# EAGLE design _logo (EAGLE 9.5.0)
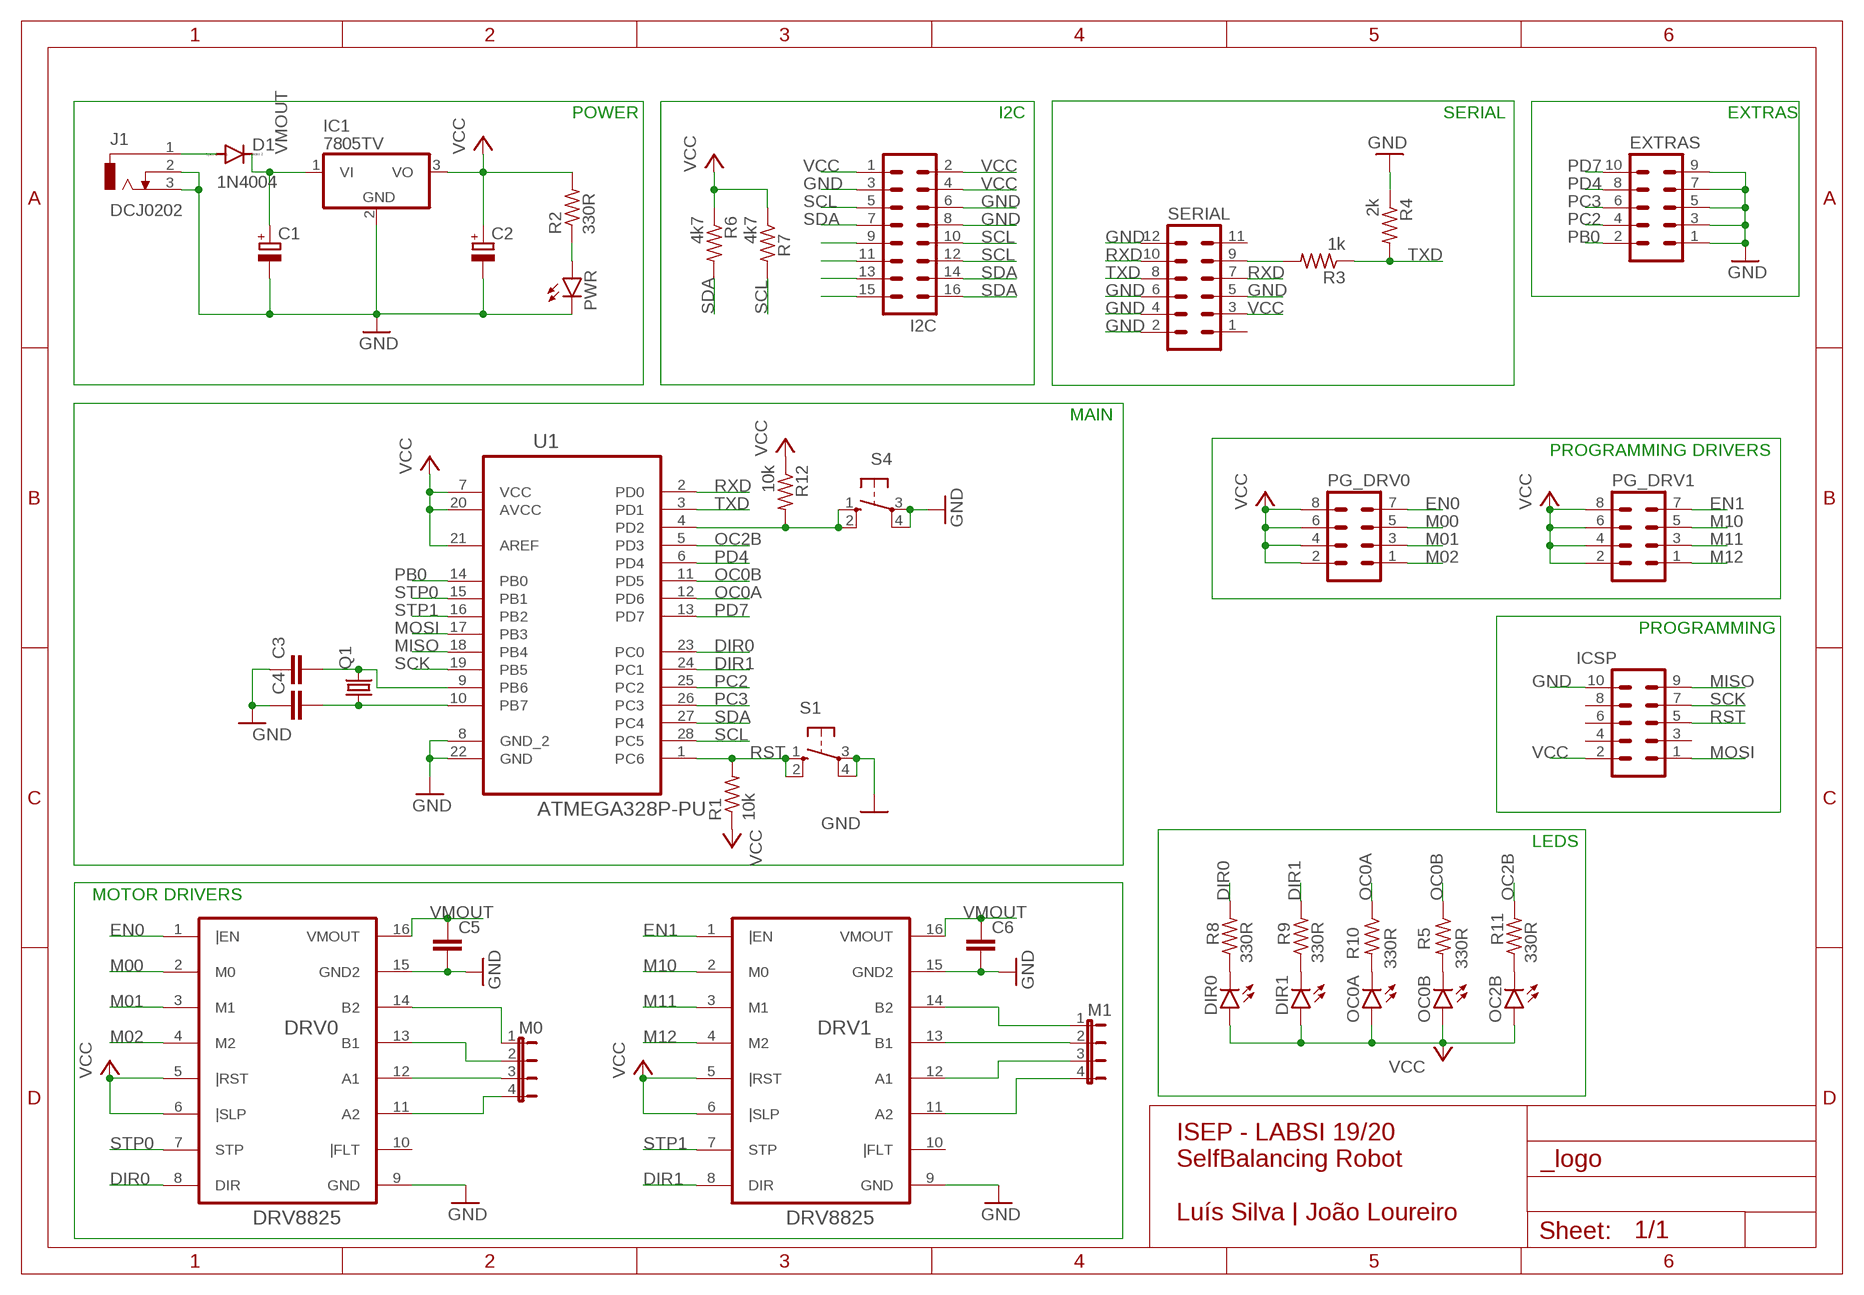
[diagram p0: schematic, sheet 1]

## Parts
C1  CPOL-EUB45181A  [B45181A]
C2  CPOL-EUB45181A  [B45181A]
C3  C5/3  [C5B3]
C4  C5/3  [C5B3]
C5  C2.5/2  [C2.5-2]
C6  C2.5/2  [C2.5-2]
D1  1N4004  [DO41-10]
DIR0  LED3MM  [LED3MM]
DIR1  LED3MM  [LED3MM]
DRV0  DRV8825  [DRV8825]
DRV1  DRV8825  [DRV8825]
EXTRAS  ML10  [ML10]
I2C  MA08-2  [MA08-2]
IC1  7805TV  [TO220V]
ICSP  ML10  [ML10]
J1  DCJ0202  [DCJ0202]
M0  JP4E  [JP4]
M1  JP4E  [JP4]
OC0A  LED3MM  [LED3MM]
OC0B  LED3MM  [LED3MM]
OC2B  LED3MM  [LED3MM]
PG_DRV0  MA04-2  [MA04-2]
PG_DRV1  MA04-2  [MA04-2]
PWR  LED3MM  [LED3MM]
Q1  CRYSTALHC49S  [HC49/S]
R1  10k  R-US_0207/10  [0207/10]
R2  330R  R-US_0207/10  [0207/10]
R3  1k  R-US_0207/10  [0207/10]
R4  2k  R-US_0207/10  [0207/10]
R5  330R  R-US_0207/10  [0207/10]
R6  4k7  R-US_0207/10  [0207/10]
R7  4k7  R-US_0207/10  [0207/10]
R8  330R  R-US_0207/10  [0207/10]
R9  330R  R-US_0207/10  [0207/10]
R10  330R  R-US_0207/10  [0207/10]
R11  330R  R-US_0207/10  [0207/10]
R12  10k  R-US_0207/10  [0207/10]
S1  10-XX  [B3F-10XX]
S4  10-XX  [B3F-10XX]
SERIAL  MA06-2  [MA06-2]
U1  ATMEGA328P-PU  [DIP254P762X457-28]

## Nets
DIR0: DRV0.8(DIR) R8.2 U1.23(PC0)
DIR1: DRV1.8(DIR) R9.2 U1.24(PC1)
EN0: DRV0.1(|EN) PG_DRV0.7
EN1: DRV1.1(|EN) PG_DRV1.7
GND [power]: C1.- C2.- C3.1 C4.1 C5.2 C6.2 DRV0.9(GND) DRV0.15(GND2) DRV1.9(GND) DRV1.15(GND2) EXTRAS.1 EXTRAS.3 EXTRAS.5 EXTRAS.7 EXTRAS.9 I2C.3 I2C.6 I2C.8 IC1.2(GND) ICSP.10 J1.2 J1.3 PWR.K(C) R4.1 S1.3(P) S1.4(P1) S4.3(P) S4.4(P1) SERIAL.2 SERIAL.4 SERIAL.5 SERIAL.6 SERIAL.12 U1.8(GND_2) U1.22(GND)
M00: DRV0.2(M0) PG_DRV0.5
M01: DRV0.3(M1) PG_DRV0.3
M02: DRV0.4(M2) PG_DRV0.1
M10: DRV1.2(M0) PG_DRV1.5
M11: DRV1.3(M1) PG_DRV1.3
M12: DRV1.4(M2) PG_DRV1.1
MISO: ICSP.9 U1.18(PB4)
MOSI: ICSP.1 U1.17(PB3)
N$1: DRV0.14(B2) M0.1
N$2: PWR.A R2.1
N$5: D1.A J1.1
N$6: C4.2 Q1.1 U1.10(PB7)
N$7: C3.2 Q1.2 U1.9(PB6)
N$9: R3.2 SERIAL.9
N$11: OC0B.K(C) R5.2
N$12: I2C.9
N$13: I2C.11
N$14: I2C.13
N$15: I2C.15
N$17: DIR0.K(C) R8.1
N$18: DIR1.K(C) R9.1
N$20: OC0A.K(C) R10.2
N$22: OC2B.K(C) R11.1
N$31: DRV0.13(B1) M0.2
N$32: DRV0.12(A1) M0.3
N$33: DRV0.11(A2) M0.4
N$46: DRV1.14(B2) M1.1
N$47: DRV1.13(B1) M1.2
N$48: DRV1.12(A1) M1.3
N$49: DRV1.11(A2) M1.4
OC0A: R10.1 U1.12(PD6)
OC0B: R5.1 U1.11(PD5)
OC2B: R11.2 U1.5(PD3)
PB0: EXTRAS.2 U1.14(PB0)
PC2: EXTRAS.4 U1.25(PC2)
PC3: EXTRAS.6 U1.26(PC3)
PD4: EXTRAS.8 U1.6(PD4)
PD7: EXTRAS.10 U1.13(PD7)
RST: ICSP.5 R1.2 S1.1(S) S1.2(S1) U1.1(PC6)
RST1: R12.2 S4.1(S) S4.2(S1) U1.4(PD2)
RXD: SERIAL.7 SERIAL.10 U1.2(PD0)
SCK: ICSP.7 U1.19(PB5)
SCL: I2C.5 I2C.10 I2C.12 R7.2 U1.28(PC5)
SDA: I2C.7 I2C.14 I2C.16 R6.2 U1.27(PC4)
STP0: DRV0.7(STP) U1.15(PB1)
STP1: DRV1.7(STP) U1.16(PB2)
TXD: R3.1 R4.2 SERIAL.8 U1.3(PD1)
VCC [power]: C2.+ DIR0.A DIR1.A DRV0.5(|RST) DRV0.6(|SLP) DRV1.5(|RST) DRV1.6(|SLP) I2C.1 I2C.2 I2C.4 IC1.3(VO) ICSP.2 OC0A.A OC0B.A OC2B.A PG_DRV0.2 PG_DRV0.4 PG_DRV0.6 PG_DRV0.8 PG_DRV1.2 PG_DRV1.4 PG_DRV1.6 PG_DRV1.8 R1.1 R2.2 R6.1 R7.1 R12.1 SERIAL.3 U1.7(VCC) U1.20(AVCC) U1.21(AREF)
VMOUT [power]: C1.+ C5.1 C6.1 D1.C DRV0.16(VMOUT) DRV1.16(VMOUT) IC1.1(VI)
Unconnected: DRV0.10(|FLT) DRV1.10(|FLT) ICSP.3 ICSP.4 ICSP.6 ICSP.8 SERIAL.1 SERIAL.11

## Notes on the sheet
- POWER | I2C | SERIAL | EXTRAS
- MAIN
- PROGRAMMING DRIVERS
- PROGRAMMING
- LEDS
- MOTOR DRIVERS
- ISEP - LABSI 19/20
  SelfBalancing Robot
  
  Luís Silva | João Loureiro

## Library data of the parts
C1 C2 = rcl:CPOL-EU: POLARIZED CAPACITOR, European symbol; SPICEPREFIX: C
C3-C6 = capacitor-wima:C: CAPACITOR naming: grid - package width
D1 = diode:1N4004: DIODE general purpose rectifier, 1 A
DIR0 DIR1 OC0A OC0B OC2B PWR = led:LED: LED OSRAM: - CHIPLED LG R971, LG N971, LY N971, LG Q971, LY Q971, LO R971, LY R971 LH N974, LH R974 LS Q976, LO Q976, LY Q976 LO Q996 - Hyper CHIPLED LW Q18S LB Q993, LB Q99A, LB R99A - SideLED LS A670, LO A670, LY A670, LG A670, LP A670 LB A673, LV A673, LT A673, LW A673 LH A674 LY A675 LS A676, LA A676, LO A676, LY A676, LW A676 LS A679, LY A679, LG A679 - Hyper Micro SIDELED® LS Y876, LA Y876, LO Y876, LY Y876 LT Y87S - SmartLED LW L88C, LW L88S LB L89C, LB L89S, LG L890 LS L89K, LO L89K, LY L89K LS L896, LA L896, LO L896, LY L896 - TOPLED LS T670, LO T670, LY T670, LG T670, LP T670 LSG T670, LSP T670, LSY T670, LOP T670, LYG T670 LG T671, LOG T671, LSG T671 LB T673, LV T673, LT T673, LW T673 LH T674 LS T676, LA T676, LO T676, LY T676, LB T676, LH T676, LSB T676, LW T676 LB T67C, LV T67C, LT T67C, LS T67K, LO T67K, LY T67K, LW E67C LS E67B, LA E67B, LO E67B, LY E67B, LB E67C, LV E67C, LT E67C LW T67C LS T679, LY T679, LG T679 LS T770, LO T770, LY T770, LG T770, LP T770 LB T773, LV T773, LT T773, LW T773 LH T774 LS E675, LA E675, LY E675, LS T675 LS T776, LA T776, LO T776, LY T776, LB T776 LHGB T686 LT T68C, LB T68C - Hyper Mini TOPLED® LB M676 - Mini TOPLED Santana® LG M470 LS M47K, LO M47K, LY M47K Source: http://www.osram.convergy.de LUXEON: - LUMILED® LXK2-PW12-R00, LXK2-PW12-S00, LXK2-PW14-U00, LXK2-PW14-V00 LXK2-PM12-R00, LXK2-PM12-S00, LXK2-PM14-U00 LXK2-PE12-Q00, LXK2-PE12-R00, LXK2-PE12-S00, LXK2-PE14-T00, LXK2-PE14-U00 LXK2-PB12-K00, LXK2-PB12-L00, LXK2-PB12-M00, LXK2-PB14-N00, LXK2-PB14-P00, LXK2-PB14-Q00 LXK2-PR12-L00, LXK2-PR12-M00, LXK2-PR14-Q00, LXK2-PR14-R00 LXK2-PD12-Q00, LXK2-PD12-R00, LXK2-PD12-S00 LXK2-PH12-R00, LXK2-PH12-S00 LXK2-PL12-P00, LXK2-PL12-Q00, LXK2-PL12-R00 Source: www.luxeon.com KINGBRIGHT: KA-3528ASYC Source: www.kingbright.com
DRV0 DRV1 = drv_8825:DRV8825: Stepper motor driver DRV8825; AVAILABILITY: Unavailable; DESCRIPTION: 1 Pack DRV8825-PU DIP-16; MF: Generic; MP: DRV8825; PACKAGE: DIP-16 Generic; PRICE: None
EXTRAS ICSP = con-ml:ML10: HARTING; OC_FARNELL: unknown; OC_NEWARK: unknown
I2C = con-lstb:MA08-2: PIN HEADER; OC_FARNELL: unknown; OC_NEWARK: unknown
IC1 = linear:78*: Positive VOLTAGE REGULATOR Source: http://cache.national.com/ds/LM/LM78L05.pdf http://www.fairchildsemi.com/ds/LM/LM7805.pdf
J1 = con-jack:DCJ0202: DC POWER JACK Source: DCJ0202.pdf; OC_FARNELL: unknown; OC_NEWARK: unknown
M0 M1 = jumper:JP4E: JUMPER
PG_DRV0 PG_DRV1 = con-lstb:MA04-2: PIN HEADER; OC_FARNELL: unknown; OC_NEWARK: unknown
Q1 = crystal:CRYSTAL: CRYSTAL; OC_FARNELL: 1667008; OC_NEWARK: unknown
R1-R12 = resistor:R-US_: RESISTOR, American symbol
S1 S4 = switch-omron:10-XX: OMRON SWITCH; MPN: B3F-1000; OC_FARNELL: 176432; OC_NEWARK: 36M3542
SERIAL = con-lstb:MA06-2: PIN HEADER; OC_FARNELL: unknown; OC_NEWARK: unknown
U1 = ATMEGA328P-PU:ATMEGA328P-PU: 8-bit Microcontroller with In-System Programmable Flash; AVAILABILITY: Unavailable; DESCRIPTION: 1 Pack ATmega328P-PU DIP-28 Chip with; MF: Generic; MP: ATMEGA328P-PU; PACKAGE: DIP-28 Generic; PRICE: None

## Net classes
0 default: clearance 0.205 mm
1 power: width 0.076 mm, clearance 0.051 mm

## Board
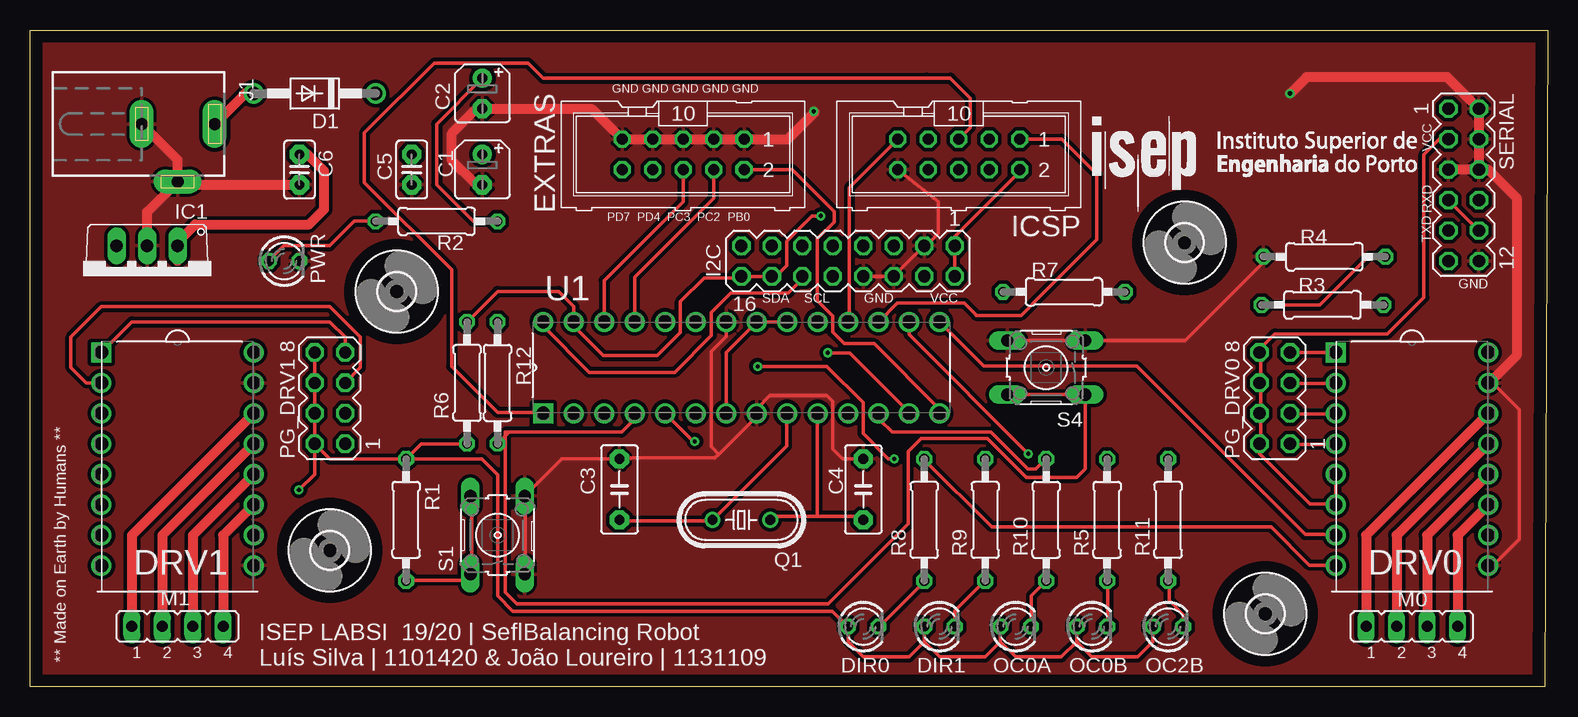
[diagram p1: board, top side]
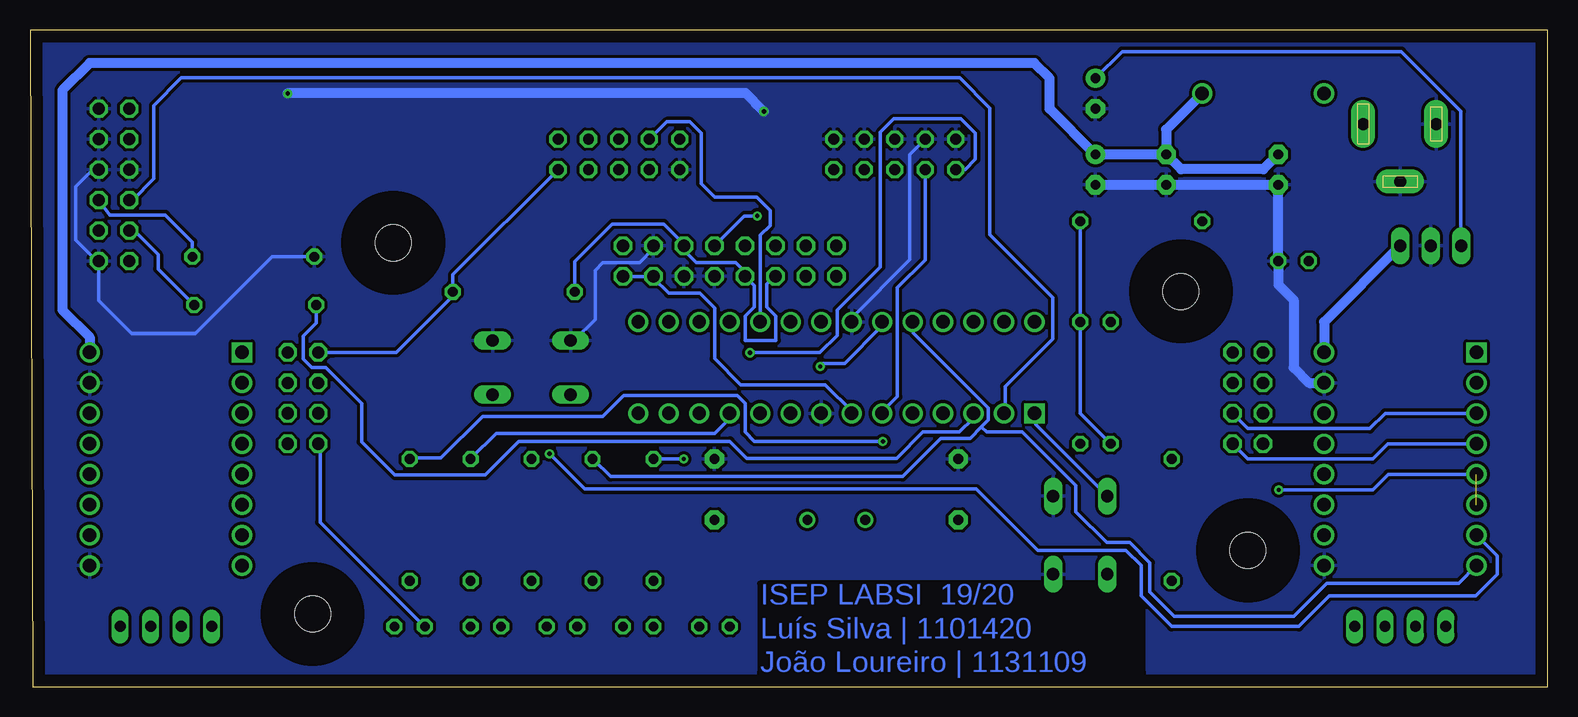
[diagram p2: board, bottom side, seen from below]

Size 126.48 x 54.78 mm. Coordinates in mm from the lower left corner, seen from the top.
Outline: 126.48,54.78 126.24,0 0,0.02 0,54.78 126.48,54.78
Copper layers (1*16): Top 0.035mm / dielectric 1.5mm / Bottom 0.035mm
Design rules "default *": minimum track width 12mil, minimum drill 0.35mm, track to track 6mil, track to pad 6mil, pad to pad 6mil, via to via 6mil, smd to smd 6mil, copper to edge 40mil, drill to drill 6mil, minimum pad ring 10mil, minimum via ring 8mil, stop-mask expansion 4mil, vias tented up to drill 0mil, thermal gap 10mil

### Footprints (pad centres in the part's own frame; a part is rotated, then mirrored left to right if it is on the bottom)
B45181A = drill 0.813 pad 1.6: + -1.27,0 | drill 0.813 pad 1.6 octagon: - 1.27,0
C5B3 = drill 0.813 pad 1.6 octagon: 1 -2.54,0; 2 2.54,0
C2.5-2 = drill 0.813 pad 1.6 octagon: 1 -1.27,0; 2 1.27,0
DO41-10 = drill 1.118: A 5.08,0; C -5.08,0
LED3MM = drill 0.813 octagon: A -1.27,0; K 1.27,0
DRV8825 = drill 1.118 square: 1 -11.43,17.78 | drill 1.118: 2 -11.43,15.24; 3 -11.43,12.7; 4 -11.43,10.16; 5 -11.43,7.62; 6 -11.43,5.08; 7 -11.43,2.54; 8 -11.43,0; 9 1.27,0; 10 1.27,2.54; 11 1.27,5.08; 12 1.27,7.62; 13 1.27,10.16; 14 1.27,12.7; 15 1.27,15.24; 16 1.27,17.78
ML10 = drill 0.914 octagon: 1 -5.08,-1.27; 2 -5.08,1.27; 3 -2.54,-1.27; 4 -2.54,1.27; 5 0,-1.27; 6 0,1.27; 7 2.54,-1.27; 8 2.54,1.27; 9 5.08,-1.27; 10 5.08,1.27
MA08-2 = drill 1.016 octagon: 1 -8.89,-1.27; 2 -8.89,1.27; 3 -6.35,-1.27; 4 -6.35,1.27; 5 -3.81,-1.27; 6 -3.81,1.27; 7 -1.27,-1.27; 8 -1.27,1.27; 9 1.27,-1.27; 10 1.27,1.27; 11 3.81,-1.27; 12 3.81,1.27; 13 6.35,-1.27; 14 6.35,1.27; 15 8.89,-1.27; 16 8.89,1.27
TO220V = drill 1.016 long: 1 -2.54,-2.54; 2 0,-2.54; 3 2.54,-2.54
DCJ0202 = drill 1 pad 2 long: 1 0,3.1; 2 4.8,0; 3 0,-3
JP4 = drill 0.914 long: 1 -3.81,0; 2 -1.27,0; 3 1.27,0; 4 3.81,0
MA04-2 = drill 1.016 octagon: 1 -3.81,-1.27; 2 -3.81,1.27; 3 -1.27,-1.27; 4 -1.27,1.27; 5 1.27,-1.27; 6 1.27,1.27; 7 3.81,-1.27; 8 3.81,1.27
HC49/S = drill 0.813: 1 -2.413,0; 2 2.413,0
0207/10 = drill 0.813 octagon: 1 -5.08,0; 2 5.08,0
B3F-10XX = drill 1.016 long: 1 -3.251,2.261; 2 3.251,2.261; 3 -3.251,-2.261; 4 3.251,-2.261
MA06-2 = drill 1.016 octagon: 1 -6.35,-1.27; 2 -6.35,1.27; 3 -3.81,-1.27; 4 -3.81,1.27; 5 -1.27,-1.27; 6 -1.27,1.27; 7 1.27,-1.27; 8 1.27,1.27; 9 3.81,-1.27; 10 3.81,1.27; 11 6.35,-1.27; 12 6.35,1.27
DIP254P762X457-28 = drill 1.118 square: 1 -7.62,33.02 | drill 1.118: 2 -7.62,30.48; 3 -7.62,27.94; 4 -7.62,25.4; 5 -7.62,22.86; 6 -7.62,20.32; 7 -7.62,17.78; 8 -7.62,15.24; 9 -7.62,12.7; 10 -7.62,10.16; 11 -7.62,7.62; 12 -7.62,5.08; 13 -7.62,2.54; 14 -7.62,0; 15 0,0; 16 0,2.54; 17 0,5.08; 18 0,7.62; 19 0,10.16; 20 0,12.7; 21 0,15.24; 22 0,17.78; 23 0,20.32; 24 0,22.86; 25 0,25.4; 26 0,27.94; 27 0,30.48; 28 0,33.02
3,0 = hole 3: 0,0

### Placement (x,y rotation side)
C1  37.69,43.13 270 top
C2  37.69,49.48 270 top
C3  49.12,16.46 270 top
C4  69.44,16.46 270 top
C5  31.8,43.13 270 top
C6  22.45,43.13 270 top
D1  23.72,49.48 180 top
DIR0  69.44,5.03 0 top
DIR1  75.79,5.03 0 top
DRV0  120.24,10.11 0 top
DRV1  17.37,10.11 0 top
EXTRAS  54.42,44.4 180 top
I2C  68.17,35.51 180 top
IC1  9.75,34.24 180 top
ICSP  77.4,44.4 180 top
J1  12.29,46.94 270 top
M0  115.16,5.03 0 top
M1  12.29,5.03 0 top
OC0A  82.14,5.03 0 top
OC0B  88.49,5.03 0 top
OC2B  94.84,5.03 0 top
PG_DRV0  103.73,24.08 90 top
PG_DRV1  24.99,24.08 90 top
PWR  21.18,35.51 0 top
Q1  59.28,13.92 180 top
R1  31.34,13.92 270 top
R2  33.88,38.82 0 top
R3  107.72,31.85 0 top
R4  107.87,35.87 0 top
R5  89.76,13.92 270 top
R6  36.42,25.35 90 top
R7  86.17,32.94 180 top
R8  74.52,13.92 90 top
R9  79.6,13.92 90 top
R10  84.68,13.92 270 top
R11  94.84,13.92 90 top
R12  38.96,25.35 270 top
S1  38.96,12.65 90 top
S4  84.68,26.62 180 top
SERIAL  119.47,41.86 270 top
U1  75.79,30.43 90 top
U$1  [3,0]  102.93,6.08 0 top
U$2  [3,0]  30.57,32.97 0 top
U$3  [3,0]  24.99,11.38 0 top
U$4  [3,0]  96.21,37.04 0 top

### Tracks (layer width: path | path; a pad name or v marks a point on that pad's centre or on a via)
DIR0  (via drill 0.35)
  Top 0.305: R8.2 74.53,18.94 74.54,18.94 80.13,13.35 103.42,13.35 106.62,10.15 108.69,10.15 DRV0.8 | v60.64,26.73 66.41,26.73 69.43,23.7 69.43,21.11 71.54,19.01 v72.01,19.01
  Bottom 0.305: v60.64,26.73 60.39,26.97 58.6,26.97 55.54,30.03 55.54,30.41 U1.23 | R8.2 74.49,18.97 74.47,18.99 72.03,18.99 v72.01,19.01
DIR1
  Bottom 0.305: 47.19,21.69 46.62,22.26 46.62,23.28 52.86,29.52 52.86,30.41 U1.24 | 47.19,21.69 48.15,20.73 50.57,20.73 53.75,17.54 78.09,17.54 79.49,18.94 79.5,18.94 R9.2 | 47.19,21.69 46.74,21.24 43.79,21.24 39.35,16.79 39.35,14.61 36.77,12.03 34.84,12.03 33.15,10.34 33.15,7.94 31.11,5.9 21.16,5.9 18.43,8.62 7.44,8.62 DRV1.8
EN0
  Top 0.305: PG_DRV0.7 105.12,27.87 108.69,27.87 DRV0.1
EN1
  Top 0.305: DRV1.1 8.48,30.43 24.99,30.43 26.26,29.16 PG_DRV1.7
GND  (via drill 0.35)
  Top 0.305: 120.66,43.16 SERIAL.6 | DRV0.9 121.56,10.15 121.94,10.15 124.11,12.32 124.11,23.15 121.94,25.32 121.56,25.32 DRV0.15 | I2C.8 69.56,34.24 I2C.6 72.11,34.37 74.4,36.66 I2C.3 74.53,36.66 75.68,37.81 75.68,40.47 ICSP.10 | 56.91,45.72 EXTRAS.3 57.03,45.72 | 59.45,45.72 EXTRAS.1 | 51.81,45.72 EXTRAS.7 | 54.36,45.72 EXTRAS.5 | C4.1 67.72,19 66.88,19.84 66.88,23.8 66.38,24.3 61.66,24.3 60.64,23.28 60.64,22.89 U1.8 60.51,22.77 60.51,22.51 57.39,19.4 | 41.26,15.88 41.26,9.51 S1.3 | 57.39,19.4 57.07,19.07 49.19,19.07 C3.1 | 49.17,19.07 C3.1 | U1.22 58.01,29.22 56.75,27.96 56.75,20.04 57.39,19.4 | 37.57,41.88 C1.- | 37.57,48.13 C2.- 37.82,48.13 | C5.2 31.8,41.23 | 22.53,35.51 PWR.K | 49.26,45.59 EXTRAS.9 | S1.4 44.32,19 C3.1 | SERIAL.5 118.23,43.16 | S4.4 87.8,28.88 87.92,28.76 S4.3 96.28,28.88 96.27,28.87 96.29,28.87 102.79,35.37 R4.1 102.72,35.87
  Top 0.813: IC1.2 9.75,39.6 J1.2 | J1.2 12.29,43.94 J1.3 | J1.2 12.33,42.14 12.61,41.86 C6.2 | C1.- 37.19,41.86 35.15,43.9 35.15,46.17 37.19,48.21 C2.- | C2.- 37.74,48.26 | v65.32,47.99 65.32,47.83 63.16,45.67 EXTRAS.1 EXTRAS.3 EXTRAS.5 EXTRAS.9 46.8,48.21 C2.- | v105,49.48 106.38,50.86 118.1,50.86 SERIAL.2 SERIAL.4 SERIAL.6 | SERIAL.6 SERIAL.5 | SERIAL.6 121.51,43.13 123.88,40.77 123.88,27.64 121.56,25.32
  Bottom 0.305: I2C.3 74.52,36.54 75.68,35.39 78.73,35.39 79.39,34.73 79.39,30.65 81.15,28.88 S4.4 | 22.53,41.75 C6.2 22.66,41.75 | 31.77,41.75 C5.2 | U1.22 58.01,30.77 53.16,35.63 53.16,44.4 EXTRAS.7 | R4.1 106.29,35.87 112.69,29.46 118,29.46 120.74,32.21 SERIAL.12 120.79,35.64 121.06,35.64 122.68,37.26 122.68,41.7 121.24,43.13 SERIAL.6
  Bottom 0.813: C6.2 22.53,41.79 | C6.2 C5.2 C1.- | C6.2 PWR.K 22.45,33.54 21.18,32.27 21.18,26.62 19.91,25.35 DRV1.15 | v65.32,47.99 66.87,49.54 104.95,49.54 v105,49.48
  pour Bottom (isolate 0.254): 0,55.02 126,55.02 126,0.02 0,0.02
  pour Top (isolate 0.305): 0,55.02 126,55.02 126,0.02 0,0.02
M00
  Top 0.305: PG_DRV0.5 105.12,25.32 108.69,25.32 DRV0.2
M01
  Top 0.305: PG_DRV0.3 105.12,22.77 108.69,22.77 DRV0.3
M02
  Top 0.305: PG_DRV0.1 105.12,20.22 108.69,20.22 DRV0.4
M10
  Top 0.305: PG_DRV1.5 27.53,26.62 27.53,29.16 24.99,31.7 5.94,31.7 3.4,29.16 3.4,26.62 4.67,25.35 DRV1.2
M11
  Bottom 0.305: DRV1.3 13.56,22.81 14.83,21.54 24.99,21.54 PG_DRV1.3
M12
  Bottom 0.305: DRV1.4 13.33,20.27 14.6,19 24.99,19 PG_DRV1.1
MISO
  Top 0.305: U1.18 68.28,30.54 68.28,41.64 ICSP.9
MOSI
  Top 0.305: U1.17 72.28,32 77.87,32 78.85,31.02 78.85,30.97 82.59,30.97 83.51,31.89 83.58,31.96 88.9,37.28 88.9,42.78 85.98,45.69 85.96,45.67 ICSP.1 82.4,45.59
N$1
  Top 0.813: DRV0.14 111.35,12.65 M0.1
N$2
  Top 0.305: PWR.A 19.98,35.64 21.13,36.79 24.99,36.79 24.99,36.78 27.03,38.82 R2.1
N$5
  Top 0.813: J1.1 17.93,49.48 D1.A
N$6
  Top 0.305: C4.2 69.14,14.22 65.61,14.22 | Q1.1 61.99,14.22 65.61,14.22 | 65.61,14.22 65.61,22.77 U1.10
N$7
  Top 0.305: C3.2 49.17,13.85 56.81,13.85 Q1.2 56.94,13.97 63.06,20.09 63.06,22.77 U1.9
N$9
  Bottom 0.305: SERIAL.9 117.8,38.05 115.8,36.05 115.8,34.85 R3.2
N$11
  Top 0.305: OC0B.K 89.82,5.05 89.82,8.75 R5.2
N$17
  Top 0.305: DIR0.K 70.83,5.05 74.53,8.75 R8.1
N$18
  Top 0.305: DIR1.K 77.08,5.05 77.08,6.33 79.5,8.75 R9.1
N$20
  Top 0.305: OC0A.K 83.45,5.05 83.45,7.6 84.6,8.75 R10.2
N$22
  Top 0.305: OC2B.K 96.11,6.03 94.92,7.22 94.92,8.75 R11.1
N$31
  Top 0.813: DRV0.13 113.89,12.65 M0.2
N$32
  Top 0.813: DRV0.12 116.43,12.65 M0.3
N$33
  Top 0.813: DRV0.11 118.97,12.65 M0.4
N$46
  Top 0.813: DRV1.14 8.48,12.65 M1.1
N$47
  Top 0.813: DRV1.13 11.02,12.65 M1.2
N$48
  Top 0.813: DRV1.12 13.56,12.65 M1.3
N$49
  Top 0.813: DRV1.11 16.1,12.65 M1.4
OC0A
  Top 0.305: R10.1 84.6,18.94 83.83,18.18 83.14,18.18 80.08,21.24 71.85,21.24 70.83,22.26 70.83,22.77 U1.12
OC0B
  Bottom 0.305: R5.1 89.69,19.07 87.63,21.14 69.41,21.14 68.28,22.26 68.28,22.77 U1.11
OC2B  (via drill 0.35)
  Top 0.305: v55.4,20.47 55.27,20.47 U1.5
  Bottom 0.305: v55.4,20.47 66.12,20.47 66.88,21.24 66.88,23.63 67.55,24.3 76.99,24.3 78.74,22.54 88.77,22.54 92.24,19.07 94.79,19.07 R11.2
PB0
  Top 0.305: U1.14 75.68,22.89 75.68,23.28 70.34,28.62 67.84,28.62 66.88,29.57 66.88,30.93 65.61,32.2 65.61,37.37 67.01,38.77 67.01,39.64 63.51,43.13 EXTRAS.2
PC2
  Top 0.305: 50.31,30.54 U1.25 50.39,34.19 56.96,40.76 EXTRAS.4
PC3
  Top 0.305: U1.26 47.85,33.89 54.42,40.46 EXTRAS.6
PD4
  Bottom 0.305: U1.6 55.41,22.89 55.41,23 54.2,24.21 54.2,33.29 51.89,35.6 EXTRAS.8
PD7  (via drill 0.35)
  Top 0.305: v66.48,27.87 66.48,27.86 68.29,27.86 73.13,23.02 73.13,22.89 U1.13
  Bottom 0.305: 49.17,43.27 EXTRAS.10 48.56,43.14 47.7,44 47.7,46.16 48.92,47.38 54.48,47.38 55.62,46.24 55.62,35.01 59.21,31.43 59.21,29.31 60.65,27.87 v66.48,27.87
RST
  Top 0.305: R1.2 31.45,8.88 36.17,8.88 36.68,9.39 S1.1 36.8,9.51 36.8,15.88 S1.2 | U1.1 42.67,22.89 38.97,22.89 35.13,26.73 35.13,34.81 27.87,42.07 27.87,46.2 33.69,52.02 41.5,52.02 42.77,50.75 74.68,50.75 74.69,50.77 76.7,50.77 78.36,49.11 78.36,46.64 ICSP.5
  Bottom 0.305: S1.2 36.8,16.01 42.67,21.88 42.67,22.77 U1.1
RST1
  Top 0.305: 81.55,24.43 S4.2 S4.1 | 87.92,24.43 S4.1 | 39.93,21.24 49.29,21.24 50.31,22.26 50.31,22.77 U1.4 | 39.93,21.24 39.62,21.24 39.62,7.9 40.57,6.94 66.51,6.94 73.18,13.6 73.18,19.63 74.28,20.73 79.76,20.73 83.02,17.47 87.23,17.47 87.93,18.17 S4.1 | R12.2 39.93,21.24
RXD
  Top 0.305: SERIAL.7 SERIAL.10
  Bottom 0.305: U1.2 45.22,22.89 45.22,25.06 41.26,29.01 41.26,32.48 46.49,37.71 46.49,48.26 49.02,50.79 113.86,50.79 116.16,48.48 116.16,42.36 117.93,40.59 SERIAL.7
SCK
  Bottom 0.305: 74.55,45.98 ICSP.7 73.4,47.13 71.49,47.13 70.55,46.19 70.55,41.98 69.42,40.86 65.92,40.86 64.8,39.74 64.8,38.48 65.61,37.67 65.61,30.54 U1.19
SCL
  Top 0.305: U1.28 42.79,30.41 42.79,30.03 46.59,26.24 53.72,26.24 56.78,29.3 56.78,31.2 58.41,32.84 63.19,32.84 64.33,33.98 64.33,34.24 I2C.12
  Bottom 0.305: I2C.12 64.46,34.24 65.1,33.6 65.1,31.69 64.33,30.93 64.33,28.88 66.88,28.88 66.88,30.93 66.12,31.69 66.12,33.47 66.88,34.24 I2C.10 66.9,34.64 67.65,35.39 70.96,35.39 71.98,36.41 I2C.5 72.11,36.79 72.11,37.04 73.67,38.6 77.95,38.6 81.09,35.47 R7.2
SDA  (via drill 0.35)
  Top 0.305: v65.88,39.27 65.16,39.27 63.06,37.17 63.06,35.14 62.17,34.24 I2C.14 61.78,34.24 59.36,34.24 I2C.16 59.23,34.11 56.18,34.11 54.2,32.13 54.2,29.55 52.26,27.61 47.76,27.61 45.34,30.03 45.34,30.29 U1.27 45.31,31.7 44.04,32.97 38.96,32.97 R6.2
  Bottom 0.305: v65.88,39.27 66.94,39.27 I2C.7
STP0
  Top 0.305: DRV0.7 108.69,12.7 106.26,12.7 92.22,26.74 79.47,26.74 75.8,30.41 U1.15
STP1  (via drill 0.35)
  Top 0.305: v83.19,19.44 73.25,29.37 73.25,30.41 U1.16
  Bottom 0.305: v83.19,19.44 80.25,16.5 47.63,16.5 42.51,11.38 35.15,11.38 33.88,10.11 33.88,7.57 31.34,5.03 20.75,5.03 18.2,7.57 5.99,7.57 4.2,9.36 4.2,10.92 DRV1.7
TXD
  Top 0.305: R4.2 111.52,35.87 107.5,31.85 R3.1
  Bottom 0.305: SERIAL.8 119.83,39.36 115.2,39.36 112.95,37.11 R4.2 | U1.3 47.89,22.77 47.89,22.38 49.04,21.24 52.09,21.24 54.26,19.07 66.75,19.07 68.15,20.47 85.74,20.47 88.55,17.67 96.07,17.67 98.84,20.45 98.84,23.65 101.82,26.63 103.01,26.63 103.72,27.34 103.72,29.26 102.64,30.35 R3.1
VCC  (via drill 0.35)  (1 unrouted)
  Top 0.305: R6.1 32.61,20.27 R1.1 | 7.11,36.66 IC1.3 | 60.51,30.41 U1.21 | U1.20 63.06,30.41 60.64,30.41 U1.21 | I2C.1 77.08,36.66 77.08,34.37 I2C.2 | 77.08,36.92 I2C.1 | DRV0.5 108.81,17.67 108.81,15.25 DRV0.6 108.69,15.25 106.65,15.25 102.44,19.45 102.44,20.22 PG_DRV0.2 102.57,20.35 102.57,22.77 PG_DRV0.4 102.57,22.89 102.57,25.32 PG_DRV0.6 102.57,25.44 102.57,27.87 PG_DRV0.8 102.57,27.99 102.57,28.27 103.73,29.43 113.12,29.43 116.16,32.47 116.16,44.4 117.43,45.67 SERIAL.3 118.3,45.58 | DIR0.A 67.62,5.58 | 31.45,18.94 R1.1 | R1.1 37.63,19 38.96,17.67 38.96,7.57 40.23,6.3 66.85,6.3 68.12,5.03 DIR0.A | DIR1.A 74.52,3.76 | 74.52,3.76 75.79,2.49 79.6,2.49 80.87,3.76 | OC0A.A 80.87,3.76 | 80.87,3.76 82.14,2.49 85.95,2.49 87.22,3.76 | DIR0.A 68.17,3.76 69.44,2.49 73.25,2.49 74.52,3.76 | OC0B.A 87.22,3.76 | 87.22,3.76 88.49,2.49 92.3,2.49 93.57,3.76 OC2B.A | U1.21 58.01,27.89 U1.7 | ICSP.2 82.48,42.98 77.06,37.56 I2C.1 | v22.41,16.42 23.72,17.73 PG_DRV1.2 | PG_DRV1.2 PG_DRV1.4 PG_DRV1.6 PG_DRV1.8 | PG_DRV1.2 24.99,19 R1.1 | C2.+ 33.88,46.94 33.88,41.86 36.92,38.82 R2.2
  Bottom 0.305: IC1.3 7.24,36.79 7.24,48 12.21,52.97 35.47,52.97 C2.+ | 5.98,17.8 DRV1.5 13.29,17.73 14.6,16.42 v22.41,16.42 | I2C.2 76.95,34.24 I2C.4 74.53,34.11 73.25,32.84 70.69,32.84 69.43,31.58 69.43,27.36 67.26,25.19 60.19,25.19 57.96,22.96 57.96,22.89 U1.7 | 93.52,5.05 OC2B.A 93.65,5.05 102.31,13.72 102.31,20.09 102.44,20.22 PG_DRV0.2 | 101.14,27.89 PG_DRV0.8 95.94,27.89 91.25,32.59 R7.1 91.25,34.37 ICSP.2 82.48,42.93 | R2.2 R12.1 38.96,22.81 R6.1
VMOUT
  Top 0.813: 12.29,35.51 IC1.1 12.29,37.08 13.76,38.55 23.24,38.55 24.51,39.82 24.51,43.02 23.13,44.4 C6.1
  Bottom 0.305: 12.33,36.79 IC1.1 | 22.53,44.43 C6.1 | 18.6,27.99 DRV1.16 | 37.82,44.43 C1.+
  Bottom 0.813: DRV0.16 121.51,29.16 123.78,31.43 123.78,49.75 121.51,52.02 42.77,52.02 41.5,50.75 41.5,48.21 C1.+ C5.1 | C6.1 23.7,43.16 30.56,43.16 C5.1 | C5.1 31.8,46.48 D1.C | IC1.1 18.64,30.43 DRV1.16

### Text on the board
Bottom: ISEP LABSI 19/20 / Luís Silva | 1101420 / João Loureiro | 1131109
tNames: GND | GND | GND | GND | GND | VCC | PD7 | PD4 | PC3 | PC2 | PB0 | RXD | TXD | GND | SDA | SCL | GND | VCC | ** Made on Earth by Humans ** | ISEP LABSI 19/20 | SeflBalancing Robot / Luís Silva | 1101420 & João Loureiro | 1131109